# Altium schematic sheet TS.SchDoc
size A4
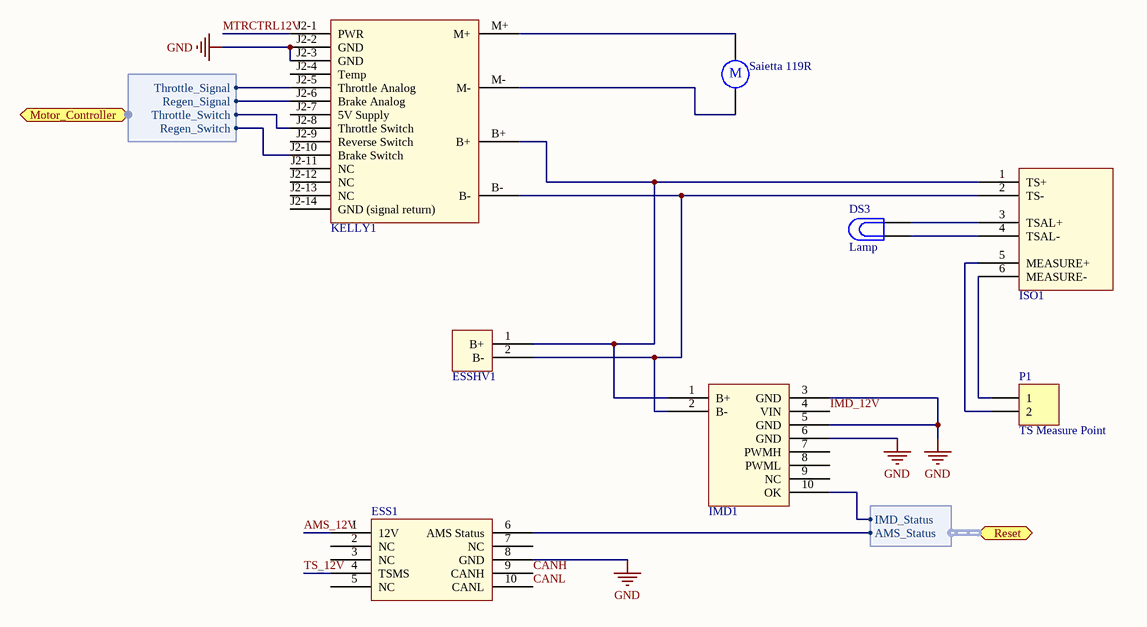
[diagram p0: TS.SchDoc]

## Parts
B4  Saietta 119R  [RB5-10.5]
DS3  Lamp  [PIN2]
ESS1  (no value)
ESSHV1  ESS High Voltage  (value not drawn)
IMD1  IMD  (value not drawn)
ISO1  Isolation Board  (value not drawn)
KELLY1  Kelly MC  (value not drawn)
P1  TS Measure Point  [HDR1X2]

## Ports
Motor_Controller (harness Motor Controller), Reset (harness Reset)

## Harnesses
Motor Controller: Throttle_Signal, Regen_Signal, Throttle_Switch, Regen_Switch
Reset: AMS_Status, IMD_Status

## Nets
GND: ESS1.8(GND) IMD1.3(GND) IMD1.5(GND) IMD1.6(GND) KELLY1.J2-2(GND) KELLY1.J2-3(GND)
AMS_12V: ESS1.1(12V)
CANH: ESS1.9(CANH)
CANL: ESS1.10(CANL)
IMD_12V: IMD1.4(VIN)
MTRCTRL12V: KELLY1.J2-1(PWR)
TS_12V: ESS1.4(TSMS)
NetB4_1: B4.1 KELLY1.M+
NetB4_2: B4.2 KELLY1.M-
NetDS3_1: DS3.1 ISO1.4(TSAL-)
NetDS3_2: DS3.2 ISO1.3(TSAL+)
NetESS1_6: ESS1.6(AMS_Status) ; port Reset.AMS_Status
NetESSHV1_1: ESSHV1.1(B+) IMD1.1(B+) ISO1.1(TS+) KELLY1.B+
NetESSHV1_2: ESSHV1.2(B-) IMD1.2(B-) ISO1.2(TS-) KELLY1.B-
NetIMD1_10: IMD1.10(OK) ; port Reset.IMD_Status
NetISO1_5: ISO1.5(MEASURE+) P1.2
NetISO1_6: ISO1.6(MEASURE-) P1.1
NetKELLY1_J2-5: KELLY1.J2-5(Throttle_Analog) ; port Motor_Controller.Throttle_Signal
NetKELLY1_J2-6: KELLY1.J2-6(Brake_Analog) ; port Motor_Controller.Regen_Signal
NetKELLY1_J2-8: KELLY1.J2-8(Throttle_Switch) ; port Motor_Controller.Throttle_Switch
NetKELLY1_J2-10: KELLY1.J2-10(Brake_Switch) ; port Motor_Controller.Regen_Switch

Not connected (* = marked no-connect by the designer): ESS1 2(NC) 3(NC) 5(NC) 7(NC); IMD1 7(PWMH) 8(PWML) 9(NC); KELLY1 J2-4(Temp) J2-7(5V_Supply) J2-9(Reverse_Switch) J2-11(NC) J2-12(NC) J2-13(NC) J2-14(GND_(signal_return))

## Notes on the sheet
- (in symbol Motor) M

## Library data of the parts
B4 = Motor: Motor, General Kind; Published: 24-Mar-1999; LatestRevisionDate: 17-Jul-2002; LatestRevisionNote: Re-released for DXP Platform.; PackageReference: RB5-10.5; Publisher: Altium Limited; PackageDescription: Capacitor (Radial); 2 Leads
DS3 = Lamp: Incandescent Bulb; Published: 24-Mar-1999; LatestRevisionDate: 17-Jul-2002; LatestRevisionNote: Re-released for DXP Platform.; PackageReference: PIN2; Publisher: Altium Limited
ESS1 = ESS 10pin
ESSHV1 = ESS HV
IMD1 = IMD: Insulation Monitoring Device
ISO1 = ISO
KELLY1 = Kelly HPM: Kelly KPM 12601 Functional Pinout
P1 = Header 2: Header, 2-Pin; LatestRevisionDate: 17-Jul-2002; LatestRevisionNote: Re-released for DXP Platform.; Publisher: Altium Limited